# EAGLE design OpenBlinds (EAGLE 9.0.0)
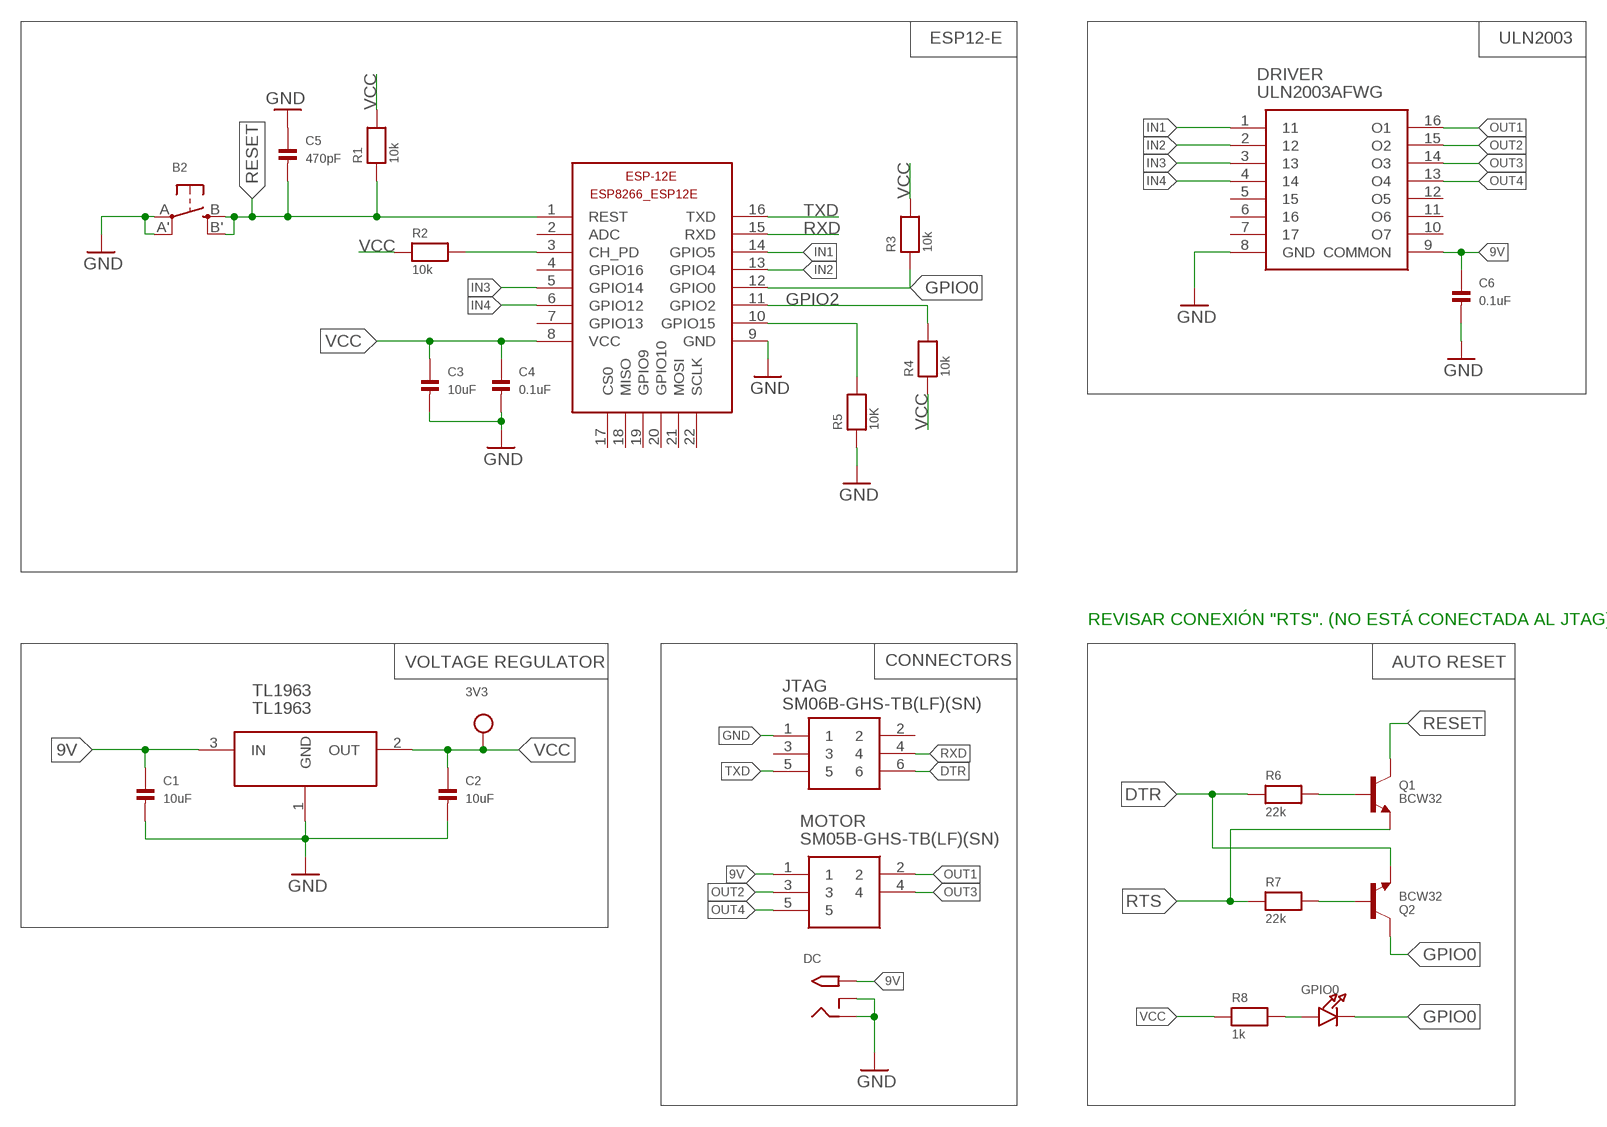
[diagram p0: schematic, sheet 1]

## Parts
3V3  TESTPOINTROUND1MM  [TESTPOINT_ROUND_1MM]
B2  SWITCH_TACT_SMT4.6X2.8  [BTN_KMR2_4.6X2.8]
C1  10uF  CAP_CERAMIC_0603  [_0603]
C2  10uF  CAP_CERAMIC_0603  [_0603]
C3  10uF  CAP_CERAMIC_0603  [_0603]
C4  0.1uF  CAP_CERAMIC_0603  [_0603]
C5  470pF  CAP_CERAMIC_0603  [_0603]
C6  0.1uF  CAP_CERAMIC_0603  [_0603]
DC  2.1MMJACKTHM  [PJ-102A]
DRIVER  ULN2003AFWG  [SOIC127P562X173-16N]
ESP-12E  ESP-12E  ESP8266-12EESP8266-ESP12E  [ESP8266-ESP12E]
GPIO0  LED0603  [CHIPLED_0603]
JTAG  SM06B-GHS-TB(LF)(SN)  [SM06B-GHS-TB]
MOTOR  SM05B-GHS-TB(LF)(SN)  [SM05B-GHS-TB]
Q1  BCW32  TRANSISTOR_NPN  [SOT23-R]
Q2  BCW32  TRANSISTOR_NPN  [SOT23-R]
R1  10k  RESISTOR_0603  [_0603]
R2  10k  RESISTOR_0603  [_0603]
R3  10k  RESISTOR_0603  [_0603]
R4  10k  RESISTOR_0603  [_0603]
R5  10K  RESISTOR_0603  [_0603]
R6  22k  RESISTOR_0603  [_0603]
R7  22k  RESISTOR_0603  [_0603]
R8  1k  RESISTOR_0603  [_0603]
TL1963  TL1963  NCP1117  [SOT223]

## Nets
9V: C1.1 C6.1 DC.TIP DRIVER.9(COMMON) MOTOR.1 TL1963.3(IN)
DONE: ESP-12E.10(GPIO15) R5.2
DTR: JTAG.6 Q2.2(E) R6.1
GND: B2.A'(P1) B2.A(P) C1.2 C2.2 C3.2 C4.2 C5.1 C6.2 DC.RING DC.RING_SW DRIVER.8(GND) ESP-12E.9(GND) JTAG.1 R5.1 TL1963.1(GND)
GPIO0: ESP-12E.12(GPIO0) GPIO0.C Q2.3(C) R3.1
GPIO2: ESP-12E.11(GPIO2) R4.2
IN1: DRIVER.1 ESP-12E.14(GPIO5)
IN2: DRIVER.2 ESP-12E.13(GPIO4)
IN3: DRIVER.3 ESP-12E.5(GPIO14)
IN4: DRIVER.4 ESP-12E.6(GPIO12)
N$4: Q1.1(B) R6.2
N$5: Q2.1(B) R7.2
N$8: GPIO0.A R8.2
N$24: ESP-12E.3(CH_PD) R2.2
OUT1: DRIVER.16(O1) MOTOR.2
OUT2: DRIVER.15(O2) MOTOR.3
OUT3: DRIVER.14(O3) MOTOR.4
OUT4: DRIVER.13(O4) MOTOR.5
RESET: B2.B'(S1) B2.B(S) C5.2 ESP-12E.1(REST) Q1.3(C) R1.1
RTS: Q1.2(E) R7.1
RXD: ESP-12E.15(RXD) JTAG.4
TXD: ESP-12E.16(TXD) JTAG.5
VCC: 3V3.P$1 C2.1 C3.1 C4.1 ESP-12E.8(VCC) R1.2 R2.1 R3.2 R4.1 R8.1 TL1963.2(OUT)
Unconnected: DRIVER.5 DRIVER.6 DRIVER.7 DRIVER.10(O7) DRIVER.11(O6) DRIVER.12(O5) ESP-12E.2(ADC) ESP-12E.4(GPIO16) ESP-12E.7(GPIO13) ESP-12E.17(CS0) ESP-12E.18(MISO) ESP-12E.19(GPIO9) ESP-12E.20(GPIO10) ESP-12E.21(MOSI) ESP-12E.22(SCLK) JTAG.2 JTAG.3

## Notes on the sheet
- ESP12-E | ULN2003
- REVISAR CONEXIÓN "RTS". (NO ESTÁ CONECTADA AL JTAG)
- VOLTAGE REGULATOR | CONNECTORS | AUTO RESET

## Library data of the parts
3V3 = microbuilder:TESTPOINT: Test Point Various test points for characterisation and PCB testing TESTPOINT_SMT - Compact Surface Mount Test Point [Digikey: 5016KTR-ND]
B2 = microbuilder:SWITCH_TACT_SMT: SMT Tact Switches 6x6mm - Digikey: P12940SCT-ND KMR2 (4.6x2.8mm) - Digikey: 401-1426-1-ND EVQ-PQHB55 - Light Touch, 160GF (4.5x4.5mm) - Digikey: P8090SCT-ND
C1-C6 = microbuilder:CAP_CERAMIC: Ceramic Capacitors 0402 - 0402 Surface Mount Capacitors 16pF 50V 5% [Digikey: 445-4899-2-ND] 18pF 50V 5% [Digikey: 490-1281-2-ND] 22pF 50V 5% [Digikey: 490-1283-2-ND] 68pF 50V 5% [Digikey: 490-1289-2-ND] 0.1uF 10V 10% [Digikey: 490-1318-2-ND] 1.0uF 6.3V 10% [Digikey: 490-1320-2-ND] 0603 - 0603 Surface Mount Capacitors 16 pF 50V 5% [Digikey: 445-5051-2-ND] 22 pF 50V [Digikey: PCC220ACVTR-ND] 33 pF 50V 5% [Digikey: 490-1415-1-ND] 56pF 50V 5% [Digikey: 490-1421-1-ND] 220pF 50V 5% [Digikey: 445-1285-1-ND] 680 pF 50V 2200 pF 50V 5% C0G [Digikey: 445-1297-1-ND] 5600 pF 100V 5% X7R [Digikey: 478-3711-1-ND] 0.1 µF 25V 10% [Digikey: PCC2277TR-ND] 0.22 µF 16V 10% X7R [Digikey: 445-1318-1-ND] 1.0 µF 25V 10% [Digikey: 445-5146-2-ND] 0603 - RF Specific 3pF 250V +/-0.1pF RF [Digikey: 712-1347-1-ND] 18 pF 250V 5% [Digikey: 478-3505-1-ND or 712-1322-1-ND] 56 pF 250V 5% C0G RF [Digikey: 490-4867-1-ND] 68 pF 250V RF [Digikey: 490-4868-1-ND] 0805 - 0805 Surface Mount Capacitors 220 pF 250V 2% RF Ceramic Capacitor [Digikey: 712-1398-1-ND] 1000 pF 50V 2% NP0 Ceramic Capacitor [Digikey: 478-3760-1-ND] 0.1 µF 25V 10% Ceramic Capacitor [Digikey: PCC1828TR-ND] 1.0 µF 16V 10% Ceramic Capacitor[Digikey: 490-1691-2-ND] 10.0 µF 10V 10% Ceramic Capacitor[Digikey: 709-1228-1-ND] 10.0 uF 16V 10% Ceramic Capacitor [Digikey: 478-5165-2-ND] 47 uF 6.3V 20% Ceramic Capacitor [Digikey: 587-1779-1-ND or 399-5506-1-ND] 1206 - 1206 Surface Mount Capacitors 47uF 10V 20% Ceramic Capacitor [Digikey: 490-5528-1-ND or 399-5508-1-ND or 445-6010-1-ND] 100uF 6.3V -20%, +80% Y5V Ceramic Capacitor (Digikey: 490-4512-1-ND, Mouser: 81-GRM31CF50J107ZE1L)
DC = adafruit:2.1MMJACK: 2.1mm x 5.5mm THM DC jack with internal switch. Digikey part #PJ-102A, 4UCON part #05537 2.1mm x 5.5mm SMT DC jack with internal switch. Digikey part #PJ-002A-SMT, 4UCON part #03267 By microbuilder.eu & adafruit.com
DRIVER = SamacSys_Parts:ULN2003AFWG: TOSHIBA - ULN2003AFWG - IC, DARL SINK DRIV, NPN, 50V, SOIC-16 Source: Datasheet <http://toshiba.semicon-storage.com/us/product/linear/transistor-array/detail.ULN2003AFWG.html>; DESCRIPTION: TOSHIBA - ULN2003AFWG - IC, DARL SINK DRIV, NPN, 50V, SOIC-16; HEIGHT: 1.73mm; MANUFACTURER_NAME: Toshiba; MANUFACTURER_PART_NUMBER: ULN2003AFWG
ESP-12E = ESP8266-ESP12E:ESP8266-12E: ESP8266-12E with additional I/O and GPIO04/05 corrected The author cannot warrant that this library is free from error or will meet your specific requirements. Created by PuceBaboon.com. Komagane, Nagano, JAPAN
GPIO0 = microbuilder:LED: LED 0603 - 0603 Surface Mount Package 2mA: Green LED - Low Power (3.9mcd, 2ma, 1.7Vf) - Digikey: 475-2709-2-ND Orange LED - Low Power (9.8mcd, 2ma, 1.8Vf) - Digikey: 475-1194-2-ND Red LED - Low Power (5mcd, 2ma, 1.8Vf) - Digikey: 475-1195-2-ND Yellow LED - Low Power (7mcd, 2ma, 1.8Vf) - Digikey: 475-1196-2-ND 5mA: Blue LED - Low Power (17mcd, 5ma, 2.9Vf) - Digikey: LNJ937W8CRACT-ND 0805 - 0805 Surface Mount Package 2mA: Red LED (8.8mcd, 2mA, 1.8Vf, Clear) - Low Power [Digikey: 475-2510-1-ND] Green LED (5mcd, 2mA, 1.8Vf, Clear) - Low Power [Digikey: 475-2730-1-ND] Yellow LED (11.3mcd, 2mA, 1.8Vf, Clear) - Low Power [Digikey: 475-2555-1-ND] 20mA: Red LED (104mcd, 20mA, Diffused) - LS R976 [Digikey: 475-1278-6-ND] Red LED (12mcd, 20mA, 2.0Vf, Clear) - APT2012EC [Digikey: 754-1128-1-ND] Green LED (15mcd, 20mA, 2.2Vf, Clear) - APT2012GC [Digikey: 754-1131-1-ND] Orange LED (160mcd, 20mA, 2.1Vf, Clear) - APT2012SECK [Digikey: 754-1130-1-ND] 1206 - 1206 Surface Mount Package Green LED (26mcd, 20mA, Diffused) - LG N971 [Digikey: 475-1407-6-ND] Red LED (15mcd, 20mA, Diffused) - LH N974 [Digikey: 475-1416-6-ND]
JTAG = SamacSys_Parts:SM06B-GHS-TB(LF)(SN): GH 1.25mm header side entry 6 way JST GH Series, 1.25mm Pitch 6 Way Right Angle PCB Header, Solder Termination, 1A Source: Datasheet <http://docs-emea.rs-online.com/webdocs/13ed/0900766b813ed077.pdf>; DESCRIPTION: GH 1.25mm header side entry 6 way JST GH Series, 1.25mm Pitch 6 Way Right Angle PCB Header, Solder Termination, 1A; HEIGHT: mm; MANUFACTURER_NAME: JST (JAPAN SOLDERLESS TERMINALS); MANUFACTURER_PART_NUMBER: SM06B-GHS-TB(LF)(SN); RS_PART_NUMBER: 7521800P; RS_PRICE-STOCK: http://uk.rs-online.com/web/p/products/7521800P
MOTOR = SamacSys_Parts:SM05B-GHS-TB(LF)(SN): JST GH Series, 1.25mm Pitch 5 Way Right Angle PCB Header, Solder Termination, 1A Source: Datasheet <http://docs-emea.rs-online.com/webdocs/10ce/0900766b810cef18.pdf>; DESCRIPTION: JST GH Series, 1.25mm Pitch 5 Way Right Angle PCB Header, Solder Termination, 1A; HEIGHT: mm; MANUFACTURER_NAME: JST (JAPAN SOLDERLESS TERMINALS); MANUFACTURER_PART_NUMBER: SM05B-GHS-TB(LF)(SN); RS_PART_NUMBER: 7521807P; RS_PRICE-STOCK: http://uk.rs-online.com/web/p/products/7521807P
Q1 Q2 = microbuilder:TRANSISTOR_NPN: NPN Transistor Transistor (NPN) 500mA 45V - BC817 [Digikey: 568-1631-1-ND] Transistor (NPN) 500mA 45V - BC817,215 [Mouser: 771-BC817-T/R] SOT23-R - SOT23 footprint optimised for use with solder paste and reflow ovens. SOT23-W - SOT23 footprint optimised for hand-soldering (larger pads).
R1-R8 = microbuilder:RESISTOR: Resistors 0402 - 0402 Surface Mount Package 22 Ohm 1% 1/16W [Digikey: 311-22.0LRTR-ND] 33 Ohm 5% 1/16W 1.0K 5% 1/16W 1.5K 5% 1/16W 2.0K 1% 1/16W 10.0K 1% 1/16W [Digikey: 311-10.0KLRTR-ND] 10.0K 5% 1/16W [Digikey: RMCF0402JT10K0TR-ND] 12.1K 1% 1/16W [Digikey: 311-22.0LRTR-ND] 100.0K 5% 1/16W 0603 - 0603 Surface Mount Package 0 Ohm 1/10 Watt 1% Resistor 15 Ohm 1/10 Watt 1% Resistor 33 Ohm 1/10 Watt 1% Resistor 49.9 Ohm 1/10 Watt 1% Resistor 100 Ohm 1/10 Watt 1% Resistor 150 Ohm 1/10 Watt 1% Resistor 240 Ohm 1/10 Watt 1% Resistor 390 Ohm 1/10 Watt 1% Resistor 560 Ohm 1/10 Watt 1% Resistor 680 Ohm 1/10 Watt 1% Resistor 750 Ohm 1/10 Watt 1% Resistor 1.0K Ohm 1/10 Watt 1% Resistor 1.5K Ohm 1/10 Watt 1% Resistor 2.0K Ohm 1/10 Watt 1% Resistor 2.2K Ohm 1/10 Watt 1% Resistor 3.3K Ohm 1/10 Watt 1% Resistor 4.7K Ohm 1/10 Watt 1% Resistor 10.0K Ohm 1/10 Watt 1% Resistor 12.0K Ohm 1/10 Watt 1% Resistor 12.1K Ohm 1/10 Watt 1% Resistor 20.0K Ohm 1/10 Watt 1% Resistor 33.0K Ohm 1/10 Watt 1% Resistor 100.0K Ohm 1/10 Watt 1% Resistor 0805 - 0805 Surface Mount Package 0 Ohm 1/8 Watt 1% Resistor 33 Ohm 1/8 Watt 1% Resistor 100 Ohm 1/8 Watt 1% Resistor 150 Ohm 1/8 Watt 1% Resistor 200 Ohm 1/8 Watt 1% Resistor 240 Ohm 1/8 Watt 1% Resistor 330 Ohm 1/8 Watt 1% Resistor 390 Ohm 1/8 Watt 1% Resistor 470 Ohm 1/8 Watt 1% Resistor 1.0K Ohm 1/8 Watt 1% Resistor 1.5K Ohm 1/8 Watt 1% Resistor 2.0K Ohm 1/8 Watt 1% Resistor 4.7K Ohm 1/8 Watt 1% Resistor 5.1K Ohm 1/8 Watt 1% Resistor 5.6K Ohm 1/8 Watt 1% Resistor 10.0K Ohm 1/8 Watt 1% Resistor 22.0K Ohm 1/8 Watt 1% Resistor 33.0K Ohm 1/8 Watt 1% Resistor 100K Ohm 1/8 Watt 1% Resistor 1206 - 1206 Surface Mount Package 2012 - 2010 Surface Mount Package 0.11 Ohm 1/2 Watt 1% Resistor - Digikey: RHM.11UCT-ND
TL1963 = Eagle-Library:NCP1117

## Board
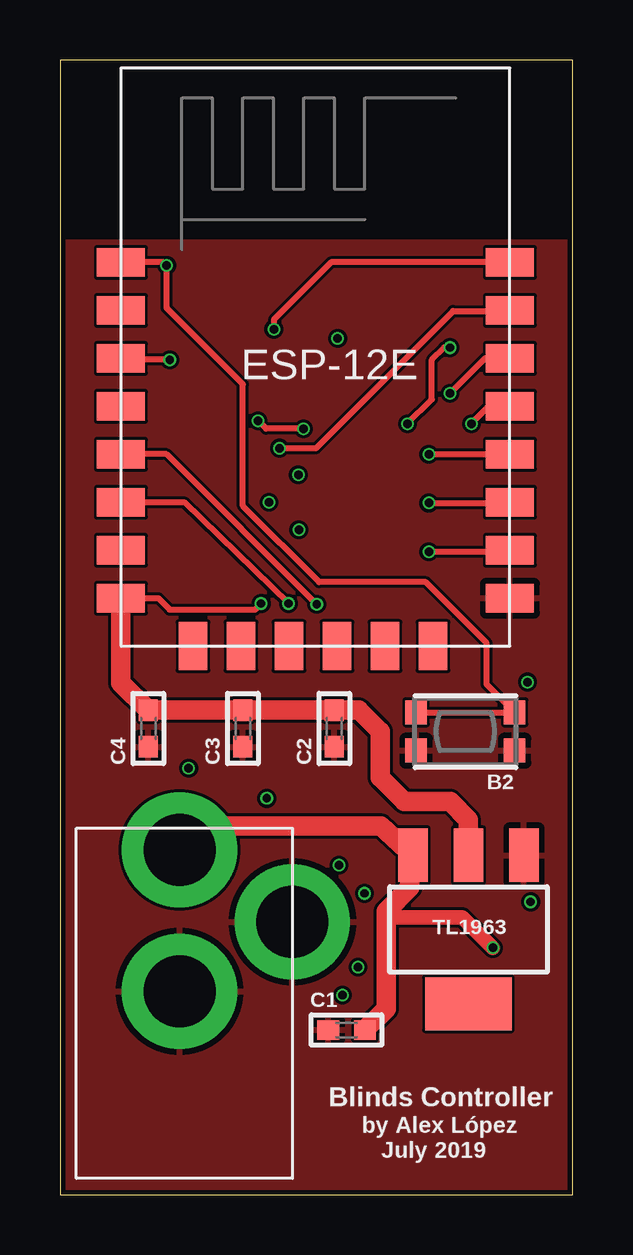
[diagram p1: board, top side]
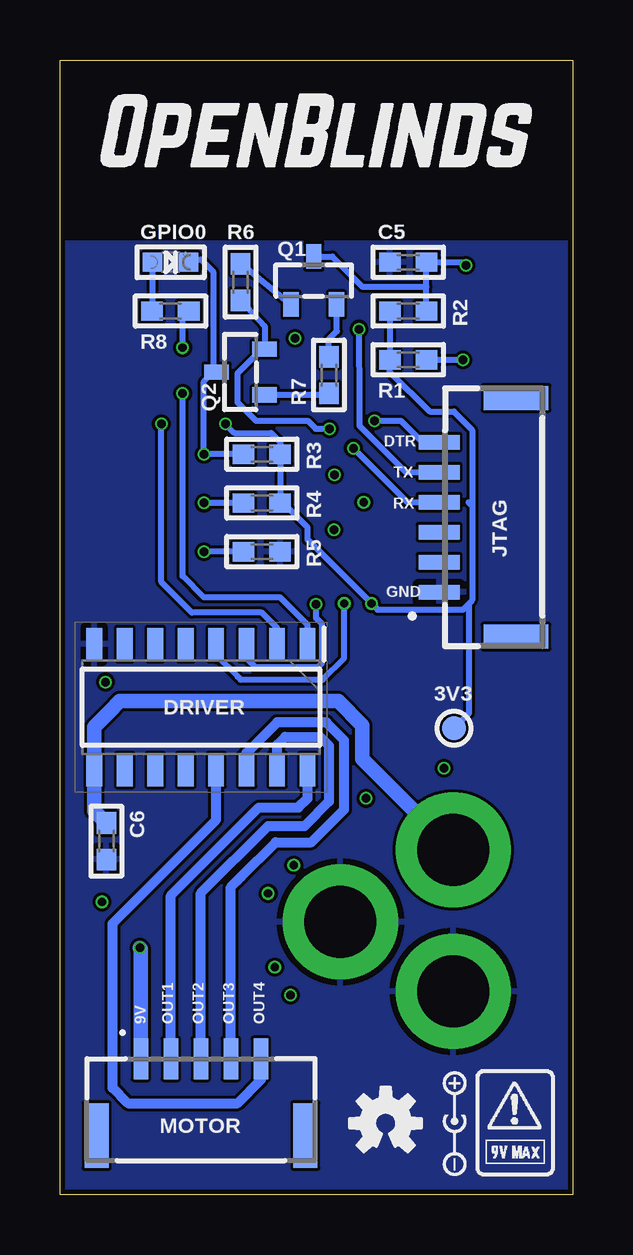
[diagram p2: board, bottom side, seen from below]

Size 21.37 x 47.3 mm. Coordinates in mm from the lower left corner, seen from the top.
Outline: 0,0 21.37,0 21.37,47.3 0,47.3 0,0
Copper layers (1*16): Top 0.035559375mm / dielectric 1.6mm / Bottom 0.035559375mm
Design rules "jlcpcb2layer": minimum track width 5mil, minimum drill 12mil, track to track 5mil, track to pad 5mil, pad to pad 5mil, via to via 5mil, smd to smd 5mil, copper to edge 8mil, drill to drill 6mil, minimum pad ring 5mil, minimum via ring 3mil, stop-mask expansion 2.5mil, vias tented up to drill 0mil, thermal gap 10mil

### Footprints (pad centres in the part's own frame; a part is rotated, then mirrored left to right if it is on the bottom)
TESTPOINT_ROUND_1MM = smd 1 x 1: P$1 0,0
BTN_KMR2_4.6X2.8 = smd 0.9 x 1: A 2.05,0.8; A' -2.05,0.8; B 2.05,-0.8; B' -2.05,-0.8
_0603 = smd 0.9 x 0.8: 1 -0.762,0; 2 0.762,0
PJ-102A = drill 3 pad 4.8: RING 0.1,-3.39; RING_SW -4.6,-6.29; TIP 0.1,-9.29
SOIC127P562X173-16N = smd 1.35 x 0.65: 1 -2.625,4.445; 2 -2.625,3.175; 3 -2.625,1.905; 4 -2.625,0.635; 5 -2.625,-0.635; 6 -2.625,-1.905; 7 -2.625,-3.175; 8 -2.625,-4.445; 9 2.625,-4.445; 10 2.625,-3.175; 11 2.625,-1.905; 12 2.625,-0.635; 13 2.625,0.635; 14 2.625,1.905; 15 2.625,3.175; 16 2.625,4.445
ESP8266-ESP12E = smd 2 x 1.2: 1 -7.62,5.84; 2 -7.62,3.84; 3 -7.62,1.84; 4 -7.62,-0.16; 5 -7.62,-2.16; 6 -7.62,-4.16; 7 -7.62,-6.16; 8 -7.62,-8.16; 9 8.58,-8.16; 10 8.58,-6.16; 11 8.58,-4.16; 12 8.58,-2.16; 13 8.58,-0.16; 14 8.58,1.84; 15 8.58,3.84; 16 8.58,5.84 | smd 1.2 x 2: 17 -4.62,-10.16; 18 -2.62,-10.16; 19 -0.62,-10.16; 20 1.38,-10.16; 21 3.38,-10.16; 22 5.38,-10.16
CHIPLED_0603 = smd 0.8 x 0.8: A 0,-0.75; C 0,0.75
SM06B-GHS-TB = smd 0.6 x 1.7: 1 2.25,4.3; 2 3.5,4.3; 3 4.75,4.3; 4 6,4.3; 5 7.25,4.3; 6 8.5,4.3 | smd 1 x 2.7: 7 0.4,1.1; 8 10.35,1.1
SM05B-GHS-TB = smd 0.6 x 1.7: 1 -2.5,0.2; 2 -1.25,0.2; 3 0,0.2; 4 1.25,0.2; 5 2.5,0.2 | smd 1 x 2.7: 6 -4.35,-3; 7 4.35,-3
SOT23-R = smd 0.635 x 1.016: 1 -0.95,-1; 2 0.95,-1; 3 0,1
SOT223 = smd 1.219 x 2.235: 1 -2.311,-3.099; 2 0,-3.099; 3 2.311,-3.099 | smd 3.6 x 2.2: 4 0,3.099

### Placement (x,y rotation side)
3V3  4.95,19.43 0 bottom
B2  16.89,19.3 180 top
C1  11.94,6.86 180 top
C2  11.43,19.43 270 top
C3  7.62,19.43 270 top
C4  3.68,19.43 270 top
C5  6.86,38.86 0 bottom
C6  19.43,14.73 270 bottom
DC  5.08,5.08 180 top
DRIVER  15.49,20.32 270 bottom
ESP-12E  10.16,33.02 0 top
GPIO0  16.76,38.86 270 bottom
JTAG  1.27,22.86 90 bottom
MOTOR  15.49,5.46 0 bottom
Q1  10.79,38.1 0 bottom
Q2  13.84,34.29 90 bottom
R1  6.86,36.83 180 bottom
R2  6.86,34.8 0 bottom
R3  12.95,30.86 0 bottom
R4  12.95,28.83 180 bottom
R5  12.95,26.8 180 bottom
R6  13.84,38.04 90 bottom
R7  10.16,34.16 270 bottom
R8  16.76,36.83 180 bottom
TL1963  17.02,11.05 180 top
U$1  [OSHW-LOGO-S]  7.8,2.98 0 bottom

### Tracks (layer width: path | path; a pad name or v marks a point on that pad's centre or on a via)
9V  (via drill 0.35)
  Top 0.61: v18.03,10.29 16.76,11.56 13.59,11.56
  Top 0.813: DC.TIP 5.98,15.37 13.36,15.37 TL1963.3 14.58,14.02 14.58,12.8 13.59,11.81 13.59,11.56 13.59,7.75 C1.1
  Bottom 0.61: MOTOR.1 17.99,10.25 v18.03,10.29 | DC.TIP 8.76,18.15 8.76,19.56 9.77,20.57 18.87,20.57 19.32,20.12 19.94,19.5 DRIVER.9 19.94,16 C6.1
DONE  (via drill 0.35)
  Top 0.254: v15.37,26.8 18.68,26.8 ESP-12E.10
  Bottom 0.254: R5.2 v15.37,26.8
DTR  (via drill 0.35)
  Top 0.254: v10.14,31.92 8.59,31.92 v8.26,32.26
  Bottom 0.254: R6.1 12.84,36.21 Q2.2 12.97,35.24 13.97,34.24 13.97,33.02 13.21,32.26 11.05,32.26 10.71,31.92 v10.14,31.92 | v8.26,32.26 7.17,32.26 6.21,31.3 5.63,31.3 JTAG.6
GND
  pour Top: 0.02,0 21.37,0 21.37,39.7 0.02,39.7
  pour Bottom: 21.37,0 21.37,39.7 0,39.7 0,0
GPIO0  (via drill 0.35)
  Top 0.254: v15.37,30.86 16.64,30.86 ESP-12E.12
  Bottom 0.254: R3.1 v15.37,30.86 15.37,33.89 14.97,34.29 Q2.3 14.99,34.31 14.99,38.48 15.49,38.99 GPIO0.C
GPIO2  (via drill 0.35)
  Top 0.254: v15.37,28.83 18.71,28.83 ESP-12E.11
  Bottom 0.254: R4.2 v15.37,28.83
IN1  (via drill 0.35)
  Top 0.254: v16.26,33.4 17.71,34.86 ESP-12E.14
  Bottom 0.254: DRIVER.1 11.05,23.75 12.19,24.89 15.37,24.89 16.26,25.78 v16.26,33.4
IN2  (via drill 0.35)
  Top 0.254: v17.14,32.13 17.87,32.86 ESP-12E.13
  Bottom 0.254: DRIVER.2 12.32,23.62 12.95,24.26 15.88,24.26 17.14,25.53 v17.14,32.13
IN3  (via drill 0.35)
  Top 0.254: v10.7,24.61 4.45,30.86 ESP-12E.5
  Bottom 0.254: DRIVER.3 13.59,22.35 13.21,21.97 13.19,21.99 10.61,21.99 10.45,22.15 10.45,23.78 10.7,24.03 v10.7,24.61
IN4  (via drill 0.35)
  Top 0.254: ESP-12E.6 5.18,28.86 v9.53,24.64
  Bottom 0.254: 14.86,22.35 DRIVER.4 14.86,22.48 13.97,21.59 13.84,21.46 10.41,21.46 9.53,22.35 v9.53,24.64
N$1  (via drill 0.35)
  other vias: 19.47,21.37
N$2  (via drill 0.35)
  other vias: 8.71,28.85
N$3  (via drill 0.35)
  other vias: 9.93,30
N$4
  Bottom 0.254: R6.2 13.89,38.86 Q1.1
N$5
  Bottom 0.254: Q2.1 10.35,33.34 R7.2
N$6  (via drill 0.35)
  other vias: 9.95,27.71
N$7  (via drill 0.35)
  other vias: 19.61,12.2
N$8
  Bottom 0.254: GPIO0.A 17.53,38.98 R8.2
N$9  (via drill 0.35)
  other vias: 11.77,8.32
N$10  (via drill 0.35)
  other vias: 12.42,9.48
N$11  (via drill 0.35)
  other vias: 12.69,12.56
N$12  (via drill 0.35)
  other vias: 11.63,13.74
N$13  (via drill 0.35)
  other vias: 11.57,35.69
N$15  (via drill 0.35)
  other vias: 5.36,17.78
N$16  (via drill 0.35)
  other vias: 8.61,16.52
N$24  (via drill 0.35)
  Top 0.254: v4.57,34.8 2.6,34.8 ESP-12E.3
  Bottom 0.254: R2.2 v4.57,34.8
OUT1
  Bottom 0.406: DRIVER.16 11.05,16.51 11.43,16.13 13.08,16.13 16.74,12.47 MOTOR.2
OUT2
  Bottom 0.406: DRIVER.15 12.32,18.74 11.98,19.08 10.53,19.08 10.16,18.71 10.16,16.38 11.18,15.37 12.7,15.37 15.49,12.57 MOTOR.3
OUT3
  Bottom 0.406: DRIVER.14 13.59,18.41 12.32,19.68 10.27,19.68 9.53,18.94 9.53,16.05 10.89,14.68 12.38,14.68 13.83,13.23 13.97,13.09 14.24,12.82 MOTOR.4
OUT4
  Bottom 0.406: DRIVER.13 14.86,15.62 19.18,11.3 19.18,4.45 18.54,3.81 13.97,3.81 12.99,4.79 MOTOR.5
RESET  (via drill 0.35)
  Top 0.254: ESP-12E.1 4.32,38.86 v4.45,38.73 4.45,36.96 7.62,33.78 7.62,28.7 10.79,25.53 15.24,25.53 17.78,22.99 17.78,21.27 B2.B' B2.B
  Bottom 0.254: v4.45,38.73 4.57,38.86 C5.2 6.1,37.85 | R1.1 6.1,37.85 | Q1.3 10.02,39.1 8.76,37.85 6.1,37.85
RTS
  Bottom 0.254: R7.1 10.16,35.67 9.84,35.99 9.84,37.09 Q1.2
RXD  (via drill 0.35)
  Top 0.254: v9.14,31.11 10.67,31.11 16.38,36.83 18.71,36.83 ESP-12E.15
  Bottom 0.254: v9.14,31.11 6.89,28.86 JTAG.4
TXD  (via drill 0.35)
  Top 0.254: ESP-12E.16 11.3,38.86 8.91,36.47 v8.91,36.07
  Bottom 0.254: v8.91,36.07 8.89,32.89 8.89,32.05 6.95,30.11 JTAG.5
VCC  (via drill 0.35)
  Top 0.254: ESP-12E.8 4.1,24.86 4.57,24.38 8.13,24.38 v8.38,24.64 | v14.48,32.13 15.49,33.15 15.49,34.8 16,35.31 v16.26,35.31
  Top 0.813: ESP-12E.8 2.54,21.34 C4.1 C3.1 C2.1 12.45,20.19 13.34,19.3 13.34,17.4 14.35,16.38 16.26,16.38 17.02,15.62 TL1963.2
  Bottom 0.254: R4.1 R3.2 12.19,31.37 12.57,31.75 14.1,31.75 v14.48,32.13 | R1.2 R2.1 7.62,34.29 5.97,32.64 4.95,32.64 4.19,31.88 4.19,28.7 | 12.32,28.83 R4.1 | 4.35,28.86 4.19,28.7 | 4.19,28.7 4.19,24.77 4.32,24.64 | 4.32,24.64 4.57,24.38 7.75,24.38 7.87,24.38 8.13,24.38 v8.38,24.64 11.05,27.3 11.05,27.81 12.06,28.83 R4.1 | v16.26,35.31 16.26,37.08 R8.1 | 3V3.P$1 4.32,20.07 4.32,24.64

### Text on the board
tPlace: Blinds Controller | by Alex López / July 2019
bPlace: DTR | TX | RX | GND | OUT4 | OUT3 | OUT2 | OUT1 | 9V